# Altium project Single Channel Monitor.PrjPcb
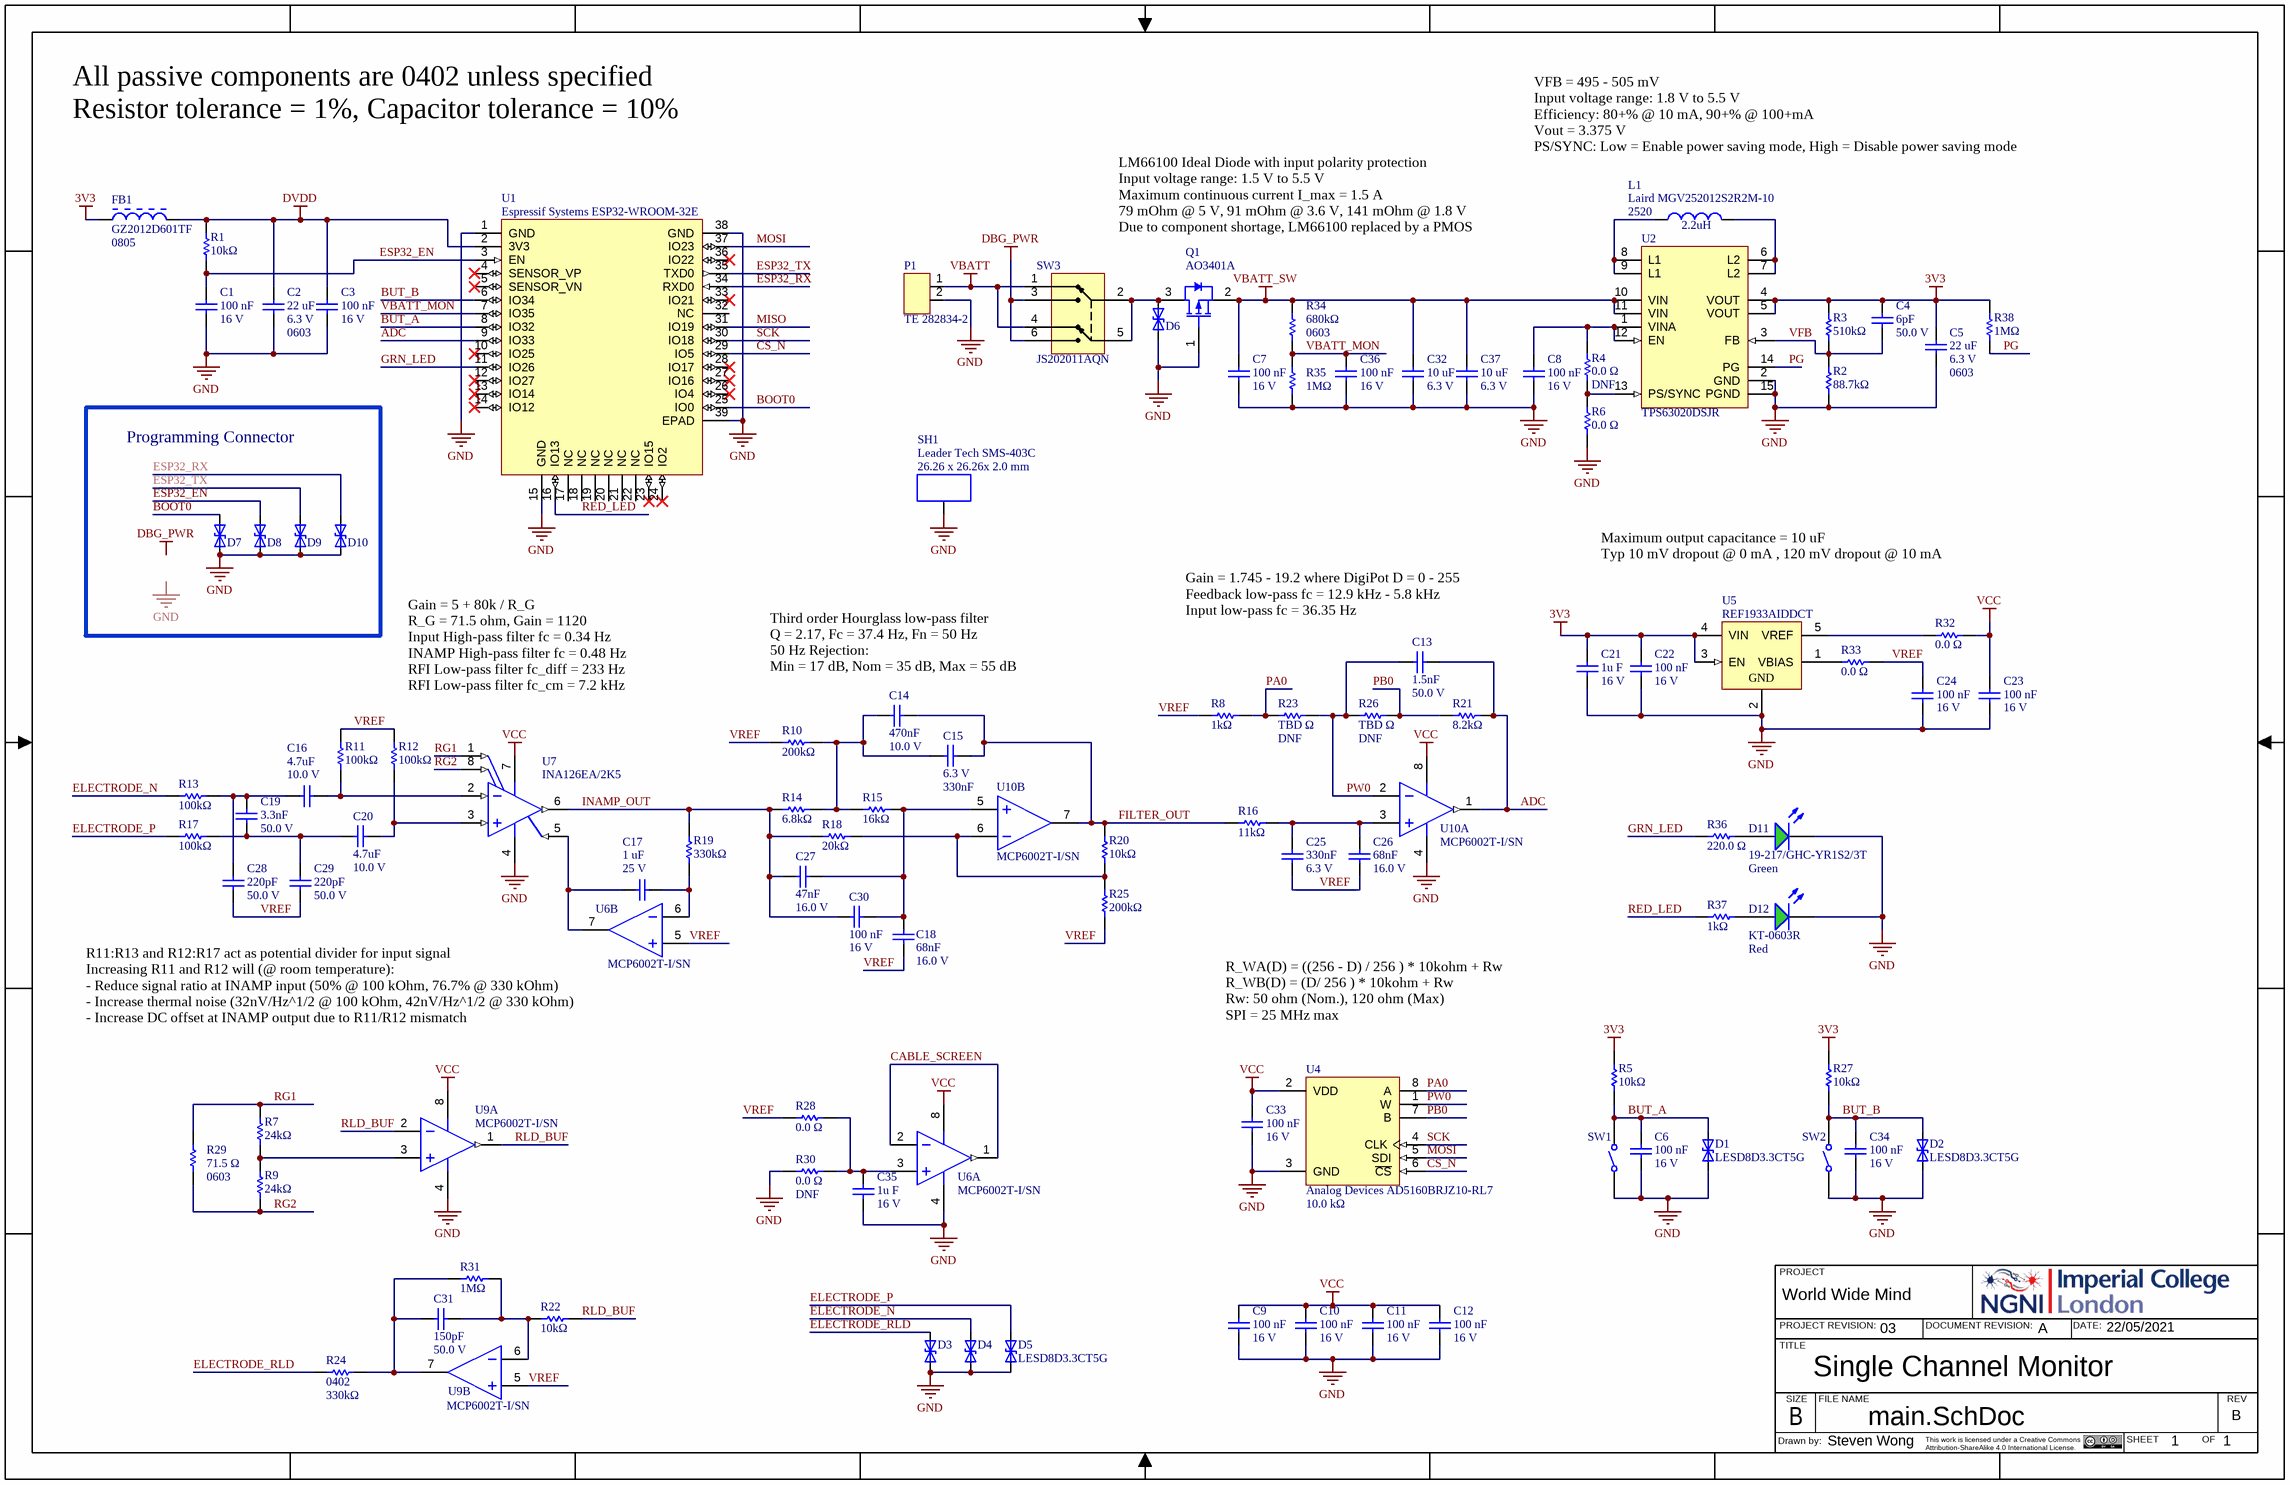
[diagram p0: main.SchDoc]
1 sheet, 103 parts. Net scope: global (net labels, ports and power ports of the same name join across sheets).
Board file: main.PcbDoc

## Sheet main.SchDoc: Single Channel Monitor
size 431 x 279 mm; Date: 22/05/2021; DrawnBy: Steven Wong; SheetNumber: 1; SheetTotal: 1; Project: World Wide Mind; ItemRev: B; ProjectRev: 03; DocumentRev: A

### Parts
C1  Capacitance: 100 nF  Voltage Rating: 16 V  [CAPC1005X56X25NL10T15]  (hidden comment: 100nF)
C2  Capacitance: 22 uF  Voltage Rating (DC): 6.3 V  Package: 0603  [CAPC1608X90X35NL10T15]  (hidden comment: Murata GRM188R60G226MEA0L)
C3  Capacitance: 100 nF  Voltage Rating: 16 V  [CAPC1005X56X25NL10T15]  (hidden comment: 100nF)
C4  Capacitance: 6pF  Voltage Rating (DC): 50.0 V  [CAPC1005X60X25NL10T15]  (hidden comment: AVX Interconnect / Elco 04025A6R0DAT2A)
C5  Capacitance: 22 uF  Voltage Rating (DC): 6.3 V  Package: 0603  [CAPC1608X90X35NL10T15]  (hidden comment: Murata GRM188R60G226MEA0L)
C6  Capacitance: 100 nF  Voltage Rating: 16 V  [CAPC1005X56X25NL10T15]  (hidden comment: 100nF)
C7  Capacitance: 100 nF  Voltage Rating: 16 V  [CAPC1005X56X25NL10T15]  (hidden comment: 100nF)
C8  Capacitance: 100 nF  Voltage Rating: 16 V  [CAPC1005X56X25NL10T15]  (hidden comment: 100nF)
C9  Capacitance: 100 nF  Voltage Rating: 16 V  [CAPC1005X56X25NL10T15]  (hidden comment: 100nF)
C10  Capacitance: 100 nF  Voltage Rating: 16 V  [CAPC1005X56X25NL10T15]  (hidden comment: 100nF)
C11  Capacitance: 100 nF  Voltage Rating: 16 V  [CAPC1005X56X25NL10T15]  (hidden comment: 100nF)
C12  Capacitance: 100 nF  Voltage Rating: 16 V  [CAPC1005X56X25NL10T15]  (hidden comment: 100nF)
C13  Capacitance: 1.5nF  Voltage Rating (DC): 50.0 V  [CAPC1005X56X25NL10T15]  (hidden comment: AVX Interconnect / Elco 04025C152KAT2A)
C14  Capacitance: 470nF  Voltage Rating (DC): 10.0 V  [CAPC1005X56X25NL10T15]  (hidden comment: AVX Interconnect / Elco 0402ZD474KAT2A)
C15  Voltage Rating (DC): 6.3 V  Capacitance: 330nF  [CAPC1005X55X25NL05T10]  (hidden comment: CL05A334KQ5NNNC)
C16  Capacitance: 4.7uF  Voltage Rating (DC): 10.0 V  [CAPC1005X56X25NL10T15]  (hidden comment: CL05A475MP5NRNC)
C17  Voltage Rating (DC): 25 V  Capacitance: 1 uF  [PCB-515da9ytrm2wahx6tw11-1]  (hidden comment: Samsung CL05A105KA5NQNC)
C18  Capacitance: 68nF  Voltage Rating (DC): 16.0 V  [CAPC1005X55X30NL05T10]  (hidden comment: Kemet C0402C683K4RACTU)
C19  Capacitance: 3.3nF  Voltage Rating (DC): 50.0 V  [CAPC1005X56X25NL10T15]  (hidden comment: AVX Interconnect / Elco 04025C332KAT2A)
C20  Capacitance: 4.7uF  Voltage Rating (DC): 10.0 V  [CAPC1005X56X25NL10T15]  (hidden comment: CL05A475MP5NRNC)
C21  Capacitance: 1u F  Voltage Rating (DC): 16 V  [CAPC1005X55X25NL05T10]  (hidden comment: Murata GRM155R61C105KA12D)
C22  Capacitance: 100 nF  Voltage Rating: 16 V  [CAPC1005X56X25NL10T15]  (hidden comment: 100nF)
C23  Capacitance: 100 nF  Voltage Rating: 16 V  [CAPC1005X56X25NL10T15]  (hidden comment: 100nF)
C24  Capacitance: 100 nF  Voltage Rating: 16 V  [CAPC1005X56X25NL10T15]  (hidden comment: 100nF)
C25  Voltage Rating (DC): 6.3 V  Capacitance: 330nF  [CAPC1005X55X25NL05T10]  (hidden comment: CL05A334KQ5NNNC)
C26  Capacitance: 68nF  Voltage Rating (DC): 16.0 V  [CAPC1005X55X30NL05T10]  (hidden comment: Kemet C0402C683K4RACTU)
C27  Capacitance: 47nF  Voltage Rating (DC): 16.0 V  [CAPC1005X56X25NL10T15]  (hidden comment: AVX Interconnect / Elco 04023C473KAT2A)
C28  Capacitance: 220pF  Voltage Rating (DC): 50.0 V  [CAPC1005X55X30NL05T10]  (hidden comment: Kemet C0402C221K5RACAUTO)
C29  Capacitance: 220pF  Voltage Rating (DC): 50.0 V  [CAPC1005X55X30NL05T10]  (hidden comment: Kemet C0402C221K5RACAUTO)
C30  Capacitance: 100 nF  Voltage Rating: 16 V  [CAPC1005X56X25NL10T15]  (hidden comment: 100nF)
C31  Capacitance: 150pF  Voltage Rating (DC): 50.0 V  [CAPC1005X56X25NL10T15]  (hidden comment: AVX Interconnect / Elco 04025A151JAT2A)
C32  Voltage Rating (DC): 6.3 V  Capacitance: 10 uF  [PCB-a41llqp6xpt8gy62f2hk-1]  (hidden comment: Samsung CL05A106MQ5NUNC)
C33  Capacitance: 100 nF  Voltage Rating: 16 V  [CAPC1005X56X25NL10T15]  (hidden comment: 100nF)
C34  Capacitance: 100 nF  Voltage Rating: 16 V  [CAPC1005X56X25NL10T15]  (hidden comment: 100nF)
C35  Capacitance: 1u F  Voltage Rating (DC): 16 V  [CAPC1005X55X25NL05T10]  (hidden comment: Murata GRM155R61C105KA12D)
C36  Capacitance: 100 nF  Voltage Rating: 16 V  [CAPC1005X56X25NL10T15]  (hidden comment: 100nF)
C37  Voltage Rating (DC): 6.3 V  Capacitance: 10 uF  [PCB-a41llqp6xpt8gy62f2hk-1]  (hidden comment: Samsung CL05A106MQ5NUNC)
D1  LESD8D3.3CT5G  [DFN64P100X50-2N]
D2  LESD8D3.3CT5G  [DFN64P100X50-2N]
D3  LESD8D3.3CT5G  [DFN64P100X50-2N]  (value not drawn)
D4  LESD8D3.3CT5G  [DFN64P100X50-2N]  (value not drawn)
D5  LESD8D3.3CT5G  [DFN64P100X50-2N]
D6  LESD8D3.3CT5G  [DFN64P100X50-2N]  (value not drawn)
D7  LESD8D3.3CT5G  [DFN64P100X50-2N]  (value not drawn)
D8  LESD8D3.3CT5G  [DFN64P100X50-2N]  (value not drawn)
D9  LESD8D3.3CT5G  [DFN64P100X50-2N]  (value not drawn)
D10  LESD8D3.3CT5G  [DFN64P100X50-2N]  (value not drawn)
D11  19-217/GHC-YR1S2/3T  Colour: Green  [PCB-qrh50x9m6cshxb6d9t7t-1]
D12  KT-0603R  Colour: Red  [PCB-qrh50x9m6cshxb6d9t7t-1]
FB1  GZ2012D601TF  Case/Package: 0805  [MURA-BLM21-H1-CHIP-2_V]
L1  Laird MGV252012S2R2M-10  Inductance: 2.2uH  Package: 2520  [INDM2520X12N]
P1  TE 282834-2  [PCB-6xrngco598u3mra2uzi2-1]
Q1  AO3401A  [PCB-kx100zt0qwbp6gbfpfbn-1]
R1  Resistance: 10kΩ  [RESC1005X40X25NL05T10]  (hidden comment: Yageo / Phycomp RC0402FR-1310KL)
R2  Resistance: 88.7kΩ  [RESC1005X40X25NL05T05]  (hidden comment: Panasonic ERJ-2RKF8872X)
R3  Resistance: 510kΩ  [RESC1005X40X25NL05T05]  (hidden comment: Vishay Dale CRCW0402510KFKED)
R4  Resistance: 0.0 Ω  Fit: DNF  [RESC1005X37X25NL05T10]  (hidden comment: Yageo AC0402JR-070RL)
R5  Resistance: 10kΩ  [RESC1005X40X25NL05T10]  (hidden comment: Yageo / Phycomp RC0402FR-1310KL)
R6  Resistance: 0.0 Ω  [RESC1005X37X25NL05T10]  (hidden comment: Yageo AC0402JR-070RL)
R7  Resistance: 24kΩ  [RESC1005X40X25NL05T10]  (hidden comment: Yageo / Phycomp RC0402FR-0724KL)
R8  Resistance: 1kΩ  [RESC1005X40X25NL10T10]  (hidden comment: KOA Speer RK73H1ETTP1001F)
R9  Resistance: 24kΩ  [RESC1005X40X25NL05T10]  (hidden comment: Yageo / Phycomp RC0402FR-0724KL)
R10  Resistance: 200kΩ  [RESC1005X40X25NL10T10]  (hidden comment: KOA Speer RK73H1ETTP2003F)
R11  Resistance: 100kΩ  [RESC1005X40X25NL05T10]  (hidden comment: Yageo RC0402FR-13100KL)
R12  Resistance: 100kΩ  [RESC1005X40X25NL05T10]  (hidden comment: Yageo RC0402FR-13100KL)
R13  Resistance: 100kΩ  [RESC1005X40X25NL05T10]  (hidden comment: Yageo RC0402FR-13100KL)
R14  Resistance: 6.8kΩ  [RESC1005X40X25NL05T05]  (hidden comment: Vishay Dale CRCW04026K80FKED)
R15  Resistance: 16kΩ  [RESC1005X40X25NL05T10]  (hidden comment: Yageo / Phycomp RC0402FR-0716KL)
R16  Resistance: 11kΩ  [RESC1005X40X25NL05T10]  (hidden comment: Yageo / Phycomp RC0402FR-0711KL)
R17  Resistance: 100kΩ  [RESC1005X40X25NL05T10]  (hidden comment: Yageo RC0402FR-13100KL)
R18  Resistance: 20kΩ  [RESC1005X40X25NL05T05]  (hidden comment: Panasonic ERJ-2RKF2002X)
R19  Resistance: 330kΩ  [RESC1005X40X25NL05T05]  (hidden comment: Vishay Dale CRCW0402330KFKED)
R20  Resistance: 10kΩ  [RESC1005X40X25NL05T10]  (hidden comment: Yageo / Phycomp RC0402FR-1310KL)
R21  Resistance: 8.2kΩ  [RESC1005X37X25NL05T10]  (hidden comment: Yageo AC0402FR-078K2L)
R22  Resistance: 10kΩ  [RESC1005X40X25NL05T10]  (hidden comment: Yageo / Phycomp RC0402FR-1310KL)
R23  Resistance: TBD Ω  Fit: DNF  [RESC1005X40X25NL05T10]  (hidden comment: Yageo / Phycomp RC0402FR-1310KL)
R24  Case/Package: 0402  Resistance: 330kΩ  [RESC1005X40X25NL05T05]  (hidden comment: Vishay Dale CRCW0402330KFKED)
R25  Resistance: 200kΩ  [RESC1005X40X25NL10T10]  (hidden comment: KOA Speer RK73H1ETTP2003F)
R26  Resistance: TBD Ω  Fit: DNF  [RESC1005X40X25NL05T10]  (hidden comment: Yageo / Phycomp RC0402FR-1310KL)
R27  Resistance: 10kΩ  [RESC1005X40X25NL05T10]  (hidden comment: Yageo / Phycomp RC0402FR-1310KL)
R28  Resistance: 0.0 Ω  [RESC1005X37X25NL05T10]  (hidden comment: Yageo AC0402JR-070RL)
R29  Case/Package: 0603  Resistance: 71.5 Ω  [RESC1608X55X30NL15T15]  (hidden comment: Panasonic ERJ-3EKF71R5V)
R30  Resistance: 0.0 Ω  Fit: DNF  [RESC1005X37X25NL05T10]  (hidden comment: Yageo AC0402JR-070RL)
R31  Resistance: 1MΩ  [RESC1005X37X25NL05T10]  (hidden comment: Yageo AC0402FR-071ML)
R32  Resistance: 0.0 Ω  [RESC1005X37X25NL05T10]  (hidden comment: Yageo AC0402JR-070RL)
R33  Resistance: 0.0 Ω  [RESC1005X37X25NL05T10]  (hidden comment: Yageo AC0402JR-070RL)
R34  Case/Package: 0603  Resistance: 680kΩ  [RESC1609X50X30NL10T20]  (hidden comment: Vishay Dale CRCW0603680KFKEA)
R35  Resistance: 1MΩ  [RESC1005X37X25NL05T10]  (hidden comment: Yageo AC0402FR-071ML)
R36  Resistance: 220.0 Ω  [RESC1005X40X25NL05T05]  (hidden comment: Vishay Dale CRCW0402220RFKED)
R37  Resistance: 1kΩ  [RESC1005X40X25NL05T10]  (hidden comment: Panasonic ERJ-U02F1001X)
R38  Resistance: 1MΩ  [RESC1005X37X25NL05T10]  (hidden comment: Yageo AC0402FR-071ML)
SH1  Leader Tech SMS-403C  Size: 26.26 x 26.26x 2.0 mm  [PCB-mz3zksww60jqn1djdwiu-1]
SW1  TS-1185-C-A-A-A  [PCB-qarcnbrnejma51b9hfzm-1]  (value not drawn)
SW2  TS-1185-C-A-A-A  [PCB-qarcnbrnejma51b9hfzm-1]  (value not drawn)
SW3  JS202011AQN  [PCB-wbq3apgbd2bliremr4t3-1]
U1  Espressif Systems ESP32-WROOM-32E  [ESP32-WROOM-32E]
U2  TPS63020DSJR  [QFN50P300X400X100_HS-15N]
U4  Analog Devices AD5160BRJZ10-RL7  Resistance: 10.0 kΩ  [TSOP65P280X145-8N]
U5  REF1933AIDDCT  [SOT95P280X100-5N]
U6  MCP6002T-I/SN  [SOIC127P600X175-8N]  (parts A,B of 2)
U7  INA126EA/2K5  [TI-DGK8_N]
U9  MCP6002T-I/SN  [SOIC127P600X175-8N]  (parts A,B of 2)
U10  MCP6002T-I/SN  [SOIC127P600X175-8N]  (parts A,B of 2)

### Blocks framed on the sheet
Programming Connector: D7-D10

### Nets
3V3: C4.1 C5.1 C21.1 C22.1 FB1.1 R3.2 R5.1 R27.1 R38.2 U2.4(VOUT) U2.5(VOUT) U5.3(EN) U5.4(VIN)
DBG_PWR: SW3.3 SW3.6
DVDD: C2.1 C3.1 FB1.2 R1.1 U1.2(3V3)
GND: C1.2 C2.2 C3.2 C5.2 C6.2 C7.2 C8.2 C9.2 C10.2 C11.2 C12.2 C21.2 C22.2 C23.2 C24.2 C32.2 C33.2 C34.2 C35.2 C36.2 C37.2 D1.1 D2.1 D3.1 D4.1 D5.1 D6.1 D7.2 D8.2 D9.2 D10.2 D11.2(K) D12.2(K) P1.2 Q1.1(G) R2.1 R6.2 R30.1 R35.2 SH1.1 SW1.1 SW2.1 U1.1(GND) U1.15(GND) U1.38(GND) U1.39(EPAD) U2.2(GND) U2.15(PGND) U4.3(GND) U5.2(GND) U6.4(V-) U7.4(V-) U9.4(V-) U10.4(V-)
VBATT: P1.1 SW3.1 SW3.4
VBATT_SW: C7.1 C32.1 C37.1 Q1.2(S) R34.1 U2.10(VIN) U2.11(VIN)
VCC: C9.1 C10.1 C11.1 C12.1 C23.1 C33.1 R32.1 U4.2(VDD) U6.8(V+) U7.7(V+) U9.8(V+) U10.8(V+)
ADC: C13.1 R21.2 U1.9(IO33) U10.1(OUT1)
BOOT0: D7.1 U1.25(IO0)
BUT_A: C6.1 D1.2 R5.2 SW1.2 U1.8(IO32)
BUT_B: C34.1 D2.2 R27.2 SW2.2 U1.6(IO34)
CABLE_SCREEN: U6.1(OUT1) U6.2(IN1-)
CS_N: U1.29(IO5) U4.6(~{CS})
ELECTRODE_N: D4.2 R13.2
ELECTRODE_P: D5.2 R17.2
ELECTRODE_RLD: D3.2 R24.1
ESP32_EN: C1.1 D8.1 R1.2 U1.3(EN)
ESP32_RX: D10.1 U1.34(RXD0)
ESP32_TX: D9.1 U1.35(TXD0)
FILTER_OUT: C14.2 C15.1 R16.2 R20.1 U10.7(OUT1)
GRN_LED: R36.2 U1.11(IO26)
INAMP_OUT: C27.1 C30.1 R14.1 R18.2 R19.2 U7.6(VO)
MISO: U1.31(IO19)
MOSI: U1.37(IO23) U4.5(SDI)
PA0: R8.1 R23.1 U4.8(A)
PB0: R21.1 R26.1 U4.7(B)
PG: R38.1 U2.14(PG)
PW0: C13.2 R23.2 R26.2 U4.1(W) U10.2(IN1-)
RED_LED: R37.2 U1.16(IO13)
RG1: R7.1 R29.1 U7.1(RG)
RG2: R9.2 R29.2 U7.8(RG)
RLD_BUF: R22.2 U9.1(OUT1) U9.2(IN1-)
SCK: U1.30(IO18) U4.4(CLK)
VBATT_MON: C36.1 R34.2 R35.1 U1.7(IO35)
VFB: C4.2 R2.2 R3.1 U2.3(FB)
VREF: C18.1 C24.1 C25.1 C26.1 C28.2 C29.2 R8.2 R10.1 R11.1 R12.1 R25.1 R28.2 R33.1 U6.5(IN2+) U9.5(IN2+)
NetC8_1: C8.1 R4.2 U2.1(VINA) U2.12(EN)
NetC14_1: C14.1 C15.2 R10.2 R14.2 R15.1
NetC16_1: C16.1 C19.2 C28.1 R13.1
NetC16_2: C16.2 R11.2 U7.2(VIN-)
NetC17_1: C17.1 R19.1 U6.6(IN2-)
NetC17_2: C17.2 U6.7(OUT1) U7.5(REF)
NetC18_2: C18.2 C27.2 C30.2 R15.2 U10.5(IN2+)
NetC19_1: C19.1 C20.2 C29.1 R17.1
NetC20_1: C20.1 R12.2 U7.3(VIN+)
NetC25_2: C25.2 C26.2 R16.1 U10.3(IN1+)
NetC31_1: C31.1 R24.2 R31.2 U9.7(OUT1)
NetC31_2: C31.2 R22.1 R31.1 U9.6(IN2-)
NetC35_1: C35.1 R28.1 R30.2 U6.3(IN1+)
NetD6_2: D6.2 Q1.3(D) SW3.2 SW3.5
NetD11_1: D11.1(A) R36.1
NetD12_1: D12.1(A) R37.1
NetL1_1: L1.1 U2.8(L1) U2.9(L1)
NetL1_2: L1.2 U2.6(L2) U2.7(L2)
NetR4_1: R4.1 R6.1 U2.13(PS/SYNC)
NetR7_2: R7.2 R9.1 U9.3(IN1+)
NetR18_1: R18.1 R20.2 R25.2 U10.6(IN2-)
NetR32_2: R32.2 U5.5(VREF)
NetR33_2: R33.2 U5.1(VBIAS)

Not connected (* = marked no-connect by the designer): U1 4(SENSOR_VP)* 5(SENSOR_VN)* 10(IO25)* 12(IO27)* 13(IO14)* 14(IO12)* 17(NC) 18(NC) 19(NC) 20(NC) 21(NC) 22(NC) 23(IO15)* 24(IO2)* 26(IO4)* 27(IO16)* 28(IO17)* 32(NC) 33(IO21)* 36(IO22)*

### Notes on the sheet
- All passive components are 0402 unless specified
  Resistor tolerance = 1%, Capacitor tolerance = 10%
- VFB = 495 - 505 mV
  Input voltage range: 1.8 V to 5.5 V
  Efficiency: 80+% @ 10 mA, 90+% @ 100+mA
  Vout = 3.375 V
  PS/SYNC: Low = Enable power saving mode, High = Disable power saving mode
- LM66100 Ideal Diode with input polarity protection
  Input voltage range: 1.5 V to 5.5 V
  Maximum continuous current I_max = 1.5 A
  79 mOhm @ 5 V, 91 mOhm @ 3.6 V, 141 mOhm @ 1.8 V
  Due to component shortage, LM66100 replaced by a PMOS
- Maximum output capacitance = 10 uF
  Typ 10 mV dropout @ 0 mA , 120 mV dropout @ 10 mA
- (near C13) Gain = 1.745 - 19.2 where DigiPot D = 0 - 255
  Feedback low-pass fc = 12.9 kHz - 5.8 kHz
  Input low-pass fc = 36.35 Hz
- Gain = 5 + 80k / R_G
  R_G = 71.5 ohm, Gain = 1120
  Input High-pass filter fc = 0.34 Hz
  INAMP High-pass filter fc = 0.48 Hz
  RFI Low-pass filter fc_diff = 233 Hz
  RFI Low-pass filter fc_cm = 7.2 kHz
- (near C14) Third order Hourglass low-pass filter
  Q = 2.17, Fc = 37.4 Hz, Fn = 50 Hz
  50 Hz Rejection:
  Min = 17 dB, Nom = 35 dB, Max = 55 dB
- (near U6) R11:R13 and R12:R17 act as potential divider for input signal
  Increasing R11 and R12 will (@ room temperature):
  - Reduce signal ratio at INAMP input (50% @ 100 kOhm, 76.7% @ 330 kOhm)
  - Increase thermal noise (32nV/Hz^1/2 @ 100 kOhm, 42nV/Hz^1/2 @ 330 kOhm)
  - Increase DC offset at INAMP output due to R11/R12 mismatch
- R_WA(D) = ((256 - D) / 256 ) * 10kohm + Rw
  R_WB(D) = (D/ 256 ) * 10kohm + Rw
  Rw: 50 ohm (Nom.), 120 ohm (Max)
  SPI = 25 MHz max
- Labels drawn without touching a wire or pin: DBG_PWR, GND
- PROJECT
- TITLE
- PROJECT REVISION:
- DOCUMENT REVISION:
- DATE:
- Drawn by:
- SIZE
- B
- FILE NAME
- SHEET
- OF
- REV
- This work is licensed under a Creative Commons Attribution-ShareAlike 4.0 International License.

### Library data of the parts
C1 C3 C6-C12 C22-C24 C30 C33 C34 C36 = CMP-bf2276a55d9a60e5-19: Ceramic capacitor SMD-0402 100nF /16V X7R# K +-10%, Samsung, RoHS; Dielectric Characteristic: X7R; Lead-Free Status: Lead Free; Mounting Style: Surface Mount; Case/Package: 0402; OctopartID: 0755ced2c795d892; LCSC Part #: C1525
C2 C5 = CMP-122043-3: Cap Ceramic 22uF 6.3V X5R 20% SMD 0603 85C Embossed T/R; Capacitance Tolerance: ±20%; Dielectric Characteristic: X5R; Mounting Style: Surface Mount; Number of Pins: 2; Octopart Url: https://octopart.com/grm188r60g226mea0l-murata-18903323; OctopartID: b8387012ec4567ff; Packaging: Cut Tape (CT); REACH SVHC Compliance: No SVHC; RoHS: Compliant; Size-Length: 0.0016 m; Size-Thickness: 0.0008 m; Size-Width: 0.0008 m; Manufacturer Part Number: GRM188R60G226MEA0L; LCSC Part #: C59461
C4 = CMP-173346-2: Multilayer Ceramic Capacitors MLCC - SMD/SMT 50volts 6pF C0G; Dielectric Characteristic: C0G/NP0; Case/Package: 0402; Octopart Url: https://octopart.com/04025a6r0dat2a-avx+interconnect+%2F+elco-2464711; OctopartID: ec20250f528133e7; Packaging: Tape; RoHS: Compliant; Manufacturer Part Number: 04025A6R0DAT2A; LCSC Part #: C30274
C13 = CMP-126494-2: Cap Ceramic 0.0015uF 50V X7R 10% SMD 0402 125C Paper T/R; Lead-Free Status: Lead Free; Manufacturer Part Number: 04025C152KAT2A; Capacitance Tolerance: ±10%; Case/Package: 0402; Dielectric Characteristic: X7R; Mounting Style: Surface Mount; Number of Pins: 2; Octopart Url: https://octopart.com/04025c152kat2a-avx+interconnect+%2F+elco-194735; OctopartID: 4e80878893499147; REACH SVHC Compliance: No SVHC; RoHS: Compliant; Size-Height: 0.00056 m; Size-Length: 0.001 m; Size-Width: 0.0005 m; LCSC Part #: C23967
C14 = CMP-4106702-2: Multilayer Ceramic Capacitors MLCC - SMD/SMT 10volts 0.47uF 10% X5R; Manufacturer Part Number: 0402ZD474KAT2A; Capacitance Tolerance: ±10%; Case/Package: 0402; Dielectric Characteristic: X5R; Mounting Style: Surface Mount; Octopart Url: https://octopart.com/0402zd474kat2a-avx+interconnect+%2F+elco-22263019; OctopartID: 2f8be7d2be06f04c; RoHS: Compliant; LCSC Part #: C47339
C15 C25 = CMP-119553-3: CAP CER 0.33UF 10V 10% X5R 0402; Lead-Free Status: Lead Free; Lifecycle Status: Active; Mounting Style: Surface Mount; Size-Height: 0.0005 m; Capacitance Tolerance: ±10%; REACH SVHC Compliance: No SVHC; OctopartID: adff64f6898b7238; Size-Length: 0.001 m; RoHS: Compliant; Manufacturer Part Number: CL05A334KQ5NNNC; LCSC Part #: C307420
C16 C20 = CMP-19563753-2: T&R / COMMERCIAL CHIP; Capacitance Tolerance: ±20%; Dielectric Characteristic: X5R; Lead-Free Status: Lead Free; Manufacturer Part Number: CL05A475MP5NRNC; Case/Package: 0402; Octopart Url: https://octopart.com/04026d475mat2a-avx+interconnect+%2F+elco-33966492; OctopartID: 16c3ddcf7a39c904; RoHS: Compliant; LCSC Part #: C23733
C17 = CMP-8f214705328650e6-4: Cap Ceramic 1uF 25V X5R 10% SMD 0402 85°C Cardboard T/R; Lead-Free Status: Lead Free; Package: 0402; Octopart URL: https://octopart.com/cl05a105ka5nqnc-samsung-19830977; Manufacturer Part Number: CL05A105KA5NQNC; RoHS: Compliant; OctopartID: 8f214705328650e6; LCSC Part #: C52923
C18 C26 = CMP-124577-2: CAP CER 0.068UF 16V 10% X7R 0402; Dielectric Material: Ceramic; Lead-Free Status: R; Capacitance Tolerance: ±10%; Case/Package: 0402; Dielectric Characteristic: X7R; Mounting Style: Surface Mount; Number of Pins: 2; Octopart Url: https://octopart.com/c0402c683k4ractu-kemet-89461; OctopartID: f9793072816a26be; Packaging: Cut Tape (CT); REACH SVHC Compliance: No SVHC; RoHS: Compliant; Size-Height: 0.0005 m; Size-Length: 0.001 m; Size-Width: 0.0005 m; Manufacturer Part Number: C0402C683K4RACTU; LCSC Part #: C12529
C19 = CMP-128367-2: AVX   04025C332KAT2A   CAP, MLCC, X7R, 3.3NF, 50V, 0402; Capacitance Tolerance: ±10%; Dielectric Material: Ceramic Multilayer; Lead-Free Status: Lead Free; Case/Package: 0402; Dielectric Characteristic: X7R; Mounting Style: Surface Mount; Number of Pins: 2; Octopart Url: https://octopart.com/04025c332kat2a-avx+interconnect+%2F+elco-194738; OctopartID: ed87248f30533240; REACH SVHC Compliance: No SVHC; RoHS: Compliant; Size-Height: 0.00056 m; Size-Length: 0.001 m; Size-Width: 0.0005 m; Manufacturer Part Number: 04025C332KAT2A; LCSC Part #: C26404
C21 C35 = CMP-7562325-2: Cap Ceramic 1uF 16V X5R 10% SMD 0402 85C Paper T/R; Lead-Free Status: Lead Free; Capacitance Tolerance: ±10%; Dielectric Characteristic: X5R; Lifecycle Status: Active; Octopart Url: https://octopart.com/grm155r61c105ka12d-murata-21407243; OctopartID: 62f2aabee19fbd35; Packaging: Cut Tape (CT); REACH SVHC Compliance: No SVHC; RoHS: Compliant; Size-Length: 0.001 m; Size-Thickness: 0.0005 m; Size-Width: 0.0005 m; Manufacturer Part Number: GRM155R61C105KA12D; Package: 0402; LCSC Part #: C52923
C27 = CMP-8988077-2: Multilayer Ceramic Capacitors MLCC - SMD/SMT 25volts 0.047uF 10% X7R 0402 SIZE; Lead-Free Status: Lead Free; Capacitance Tolerance: ±10%; Case/Package: 0402; Dielectric Characteristic: X7R; Octopart Url: https://octopart.com/04023c473kat2a-avx+interconnect+%2F+elco-27697901; OctopartID: 725fbaf3f5d4ad98; RoHS: Compliant; Manufacturer Part Number: 04023C473KAT2A; LCSC Part #: C26403
C28 C29 = CMP-3913259-2: CAPACITOR, 0402, X7R, 50V, 220PF; Capacitance Tolerance: ±10%; Dielectric Material: Ceramic; Lead-Free Status: R; Manufacturer Part Number: C0402C221K5RACAUTO; Case/Package: 0402; Dielectric Characteristic: X7R; Mounting Style: Surface Mount; Octopart Url: https://octopart.com/c0402c221k5racauto-kemet-31521984; OctopartID: 55129df88cb48ad5; Packaging: Cut Tape (CT); REACH SVHC Compliance: No SVHC; RoHS: Compliant; LCSC Part #: C1530
C31 = CMP-128358-2: AVX   04025A151JAT2A   CAP, MLCC, C0G/NP0, 150PF, 50V, 0402; Capacitance Tolerance: ±5%; Dielectric Material: Ceramic Multilayer; Lead-Free Status: Lead Free; Temperature Coefficient: 0.0 ppm/°C; Case/Package: 0402; Dielectric Characteristic: C0G/NP0; Mounting Style: Surface Mount; Number of Pins: 2; Octopart Url: https://octopart.com/04025a151jat2a-avx+interconnect+%2F+elco-194717; OctopartID: fa6a3362279125ad; REACH SVHC Compliance: No SVHC; RoHS: Compliant; Size-Height: 0.00056 m; Size-Length: 0.001 m; Size-Width: 0.0005 m; Manufacturer Part Number: 04025A151JAT2A; LCSC Part #: C1527
C32 C37 = CMP-fd5e350784e62299-2: Cap Ceramic 10uF 6.3V X5R 20% SMD 0402 85°C Paper T/R; Lead-Free Status: Lead Free; Octopart URL: https://octopart.com/cl05a106mq5nunc-samsung-22240478; Manufacturer Part Number: CL05A106MQ5NUNC; Mounting Style: Surface Mount; RoHS: Compliant; OctopartID: fd5e350784e62299; Package: 0402; LCSC Part #: C15525
D1-D10 = CMP-zjatvudan2pmebzuzrjd-1: Bidirectional 3.3V (Max) 5V 14.1V 11.2A(8/20us) SOD-882 Diodes - ESD RoHS; Manufacturer: LRC; Breakdown Voltage: 5.0 V; Maximum Reverse Leakage Current: 1 uA; Manufacturer Part Number: LESD8D3.3CT5G; Homepage URL: https://lcsc.com/product-detail/Diodes-ESD_LESD8D3-3CT5G_C172410.html; CustomComponentID: zjatvudan2pmebzuzrjd; Package: SOD-882; LCSC Part #: C172410
D11 D12 = CMP-7093b92408b7af54-1: LED SMD Top View Uni-Color Brilliant Green 518nm 0603 Pkg ø7T/R 3k"; OctopartID: 7093b92408b7af54; Octopart URL: https://octopart.com/19-217%2Fghc-yr1s2%2F3t-everlight-12410178
  D11: LCSC Part #: C72043
  D12: LCSC Part #: C2286
FB1 = CMP-887293-3: Chip Ferrite Bead for High Speed Signal lines, 330 Ohm, 400 mA, -55 to 125 degC, 2 x 1.25 x 1.05 mm SMD, Tape and Reel; Manufacturer Part Number: BLM21BB331SN1D; Case/Package (SI): 2012; Lead-Free Status: Lead Free; Number of Circuits: 1; Resistance: 330.0 Ω; Shielding: No; Mounting Style: Surface Mount; Number of Pins: 2; Octopart Url: https://octopart.com/blm21bb331sn1d-murata-47768; OctopartID: f6a33fa9695d2964; Packaging: Cut Tape (CT); REACH SVHC Compliance: No SVHC; RoHS: Compliant; Size-Length: 0.002 m; Size-Width: 0.00125 m; LCSC Part #: C1017
L1 = CMP-6756ab2d39beb891-1: MGV252012 - High Current Molded SMT Power Inductor; Octopart URL: https://octopart.com/mgv252012s2r2m-10-laird-91323278; Manufacturer Part Number: MGV252012S2R2M-10; RoHS: Compliant; OctopartID: 6756ab2d39beb891; LCSC Part #: C375952
P1 = CMP-4e52859dc8429195-26: Wire-To-Board Terminal Block, 2, 150 V, 10 A, 30 Awg, 16 Awg, 1.4 Mm; Number of Contacts: 2; Lead-Free Status: Lead Free; Wire Gauge: 16.0 AWG to 30.0 AWG; ELV Compliant: Compliant; Size-Width: 6.50 mm; Contact Plating: Tin; Mounting Style: Screw, Through Hole; RoHS: Compliant; Color: Green; Flammability Rating: UL 94 V-0; Contact Material: Brass; Octopart URL: https://octopart.com/282834-2-te+connectivity-46506870
Q1 = CMP-832298-9: MOSFET P-CH 30V 4A SOT23; Manufacturer: Alpha & Omega Semicon; LCSC Part #: C15127
R1 R5 R20 R22 R23 R26 R27 = CMP-3661304-2: Thick Film Resistors - SMD 10K OHM 1%; Lead-Free Status: Lead Free; Power Rating: 0.0625 W; Voltage Rating (DC): 50.0 V; Case/Package: 0402; Mounting Style: Surface Mount; Number of Pins: 2; Octopart Url: https://octopart.com/rc0402fr-1310kl-yageo-42863452; OctopartID: f5673ee3db5d2aa0; Packaging: Cut Tape (CT); Resistance Tolerance: ±1%; RoHS: Compliant; Size-Length: 0.001 m; Manufacturer Part Number: RC0402FR-1310KL; LCSC Part #: C25744
R2 = CMP-3682312-2: Thick Film Resistors - SMD 0402 88.7Kohms 1% Tol; Lead-Free Status: Lead Free; Power Rating: 0.1 W; Voltage Rating (DC): 50.0 V; Case/Package: 0402; Lifecycle Status: Not Listed by Manufacturer; Mounting Style: Surface Mount; Octopart Url: https://octopart.com/erj-2rkf8872x-panasonic-55421318; OctopartID: a0346a732cd47ff3; REACH SVHC Compliance: No SVHC; Resistance Tolerance: ±1%; RoHS: Compliant; Size-Height: 0.00035 m; Size-Length: 0.001 m; Size-Width: 0.0005 m; Manufacturer Part Number: ERJ-2RKF8872X; LCSC Part #: C25922
R3 = CMP-3945506-8: RES SMD 510K OHM 1% 1/16W 0402; Lead-Free Status: Lead Free; Power Rating: 0.063 W; Voltage Rating (DC): 50.0 V; Case/Package: 0402; Mounting Style: Surface Mount; Number of Pins: 2; Octopart Url: https://octopart.com/crcw0402510kfked-vishay-39803012; OctopartID: ab2d6078d6cf74ea; REACH SVHC Compliance: No SVHC; Resistance Tolerance: ±1%; RoHS: Compliant; Size-Height: 0.00035 m; Size-Length: 0.001 m; Size-Width: 0.0005 m; Manufacturer Part Number: CRCW0402510KFKED; LCSC Part #: C11616
R4 R6 R28 R30 R32 R33 = CMP-1900348-2: RES SMD 0.0 OHM JUMPER 1/16W; Lead-Free Status: Lead Free; Resistance Tolerance: ±5%; Manufacturer Part Number: AC0402JR-070RL; Case/Package: 0402; Mounting Style: Surface Mount; Octopart Url: https://octopart.com/ac0402jr-070rl-yageo-21711084; OctopartID: 9e9b56daf311415c; RoHS: Compliant; LCSC Part #: C17168
R7 R9 = CMP-1900184-2: RESISTOR, 0402 0.063W 1% 24K; Lead-Free Status: Lead Free; Power Rating: 0.0625 W; Voltage Rating (DC): 50.0 V; Manufacturer Part Number: RC0402FR-0724KL; Case/Package: 0402; Mounting Style: Surface Mount; Number of Pins: 2; Octopart Url: https://octopart.com/rc0402fr-0724kl-yageo-42334447; OctopartID: 081fc390d596d7d8; REACH SVHC Compliance: No SVHC; Resistance Tolerance: ±1%; RoHS: Compliant; LCSC Part #: C25769
R8 = CMP-2823544-2: Res Thick Film 0402 1K Ohm 1% 0.063W(1/16W) ±100ppm/C Molded SMD Automotive Punched Paper T/R; Lead-Free Status: Lead Free; Temperature Coefficient: 100.0 ppm/°C; Voltage Rating (DC): 50.0 V; Case/Package: 0402; Octopart Url: https://octopart.com/rk73h1ettp1001f-koa+speer-2165773; OctopartID: 54d59dfe7dbe8b12; Power Rating: 0.063 W; Resistance Tolerance: ±1%; RoHS: Compliant; Size-Length: 0.001 m; Size-Width: 0.0005 m; Manufacturer Part Number: RK73H1ETTP1001F; LCSC Part #: C11702
R10 R25 = CMP-2823564-2: Res Thick Film 0402 200K Ohm 1% 0.063W(1/16W) ±100ppm/C Molded SMD Automotive Punched Paper T/R; Lead-Free Status: Lead Free; Temperature Coefficient: 100.0 ppm/°C; Voltage Rating (DC): 50.0 V; Manufacturer Part Number: RK73H1ETTP2003F; Case/Package: 0402; Octopart Url: https://octopart.com/rk73h1ettp2003f-koa+speer-2165923; OctopartID: dfa21689f6670065; Power Rating: 0.063 W; Resistance Tolerance: ±1%; RoHS: Compliant; Size-Length: 0.001 m; Size-Width: 0.0005 m; LCSC Part #: C25764
R11-R13 R17 = CMP-3759242-3: YAGEO   RC0402FR-13100KL   THICK FILM RESISTOR, 100KOHM, 62.5mW 1%; Power Rating: 0.0625 W; Voltage Rating (DC): 50.0 V; Lead-Free Status: Lead Free; Size-Length: 0.001 m; RoHS: Compliant; Case/Package: 0402; Packaging: Cut Tape (CT); Manufacturer Part Number: RC0402FR-13100KL; OctopartID: 302bf9acc9e8efec; Resistance Tolerance: ±1%; Mounting Style: Surface Mount; Octopart Url: https://octopart.com/rc0402fr-13100kl-yageo-9297061; LCSC Part #: C25741
R14 = CMP-1856508-2: RES SMD 6.8K OHM 1% 1/16W 0402; Lead-Free Status: Lead Free; Power Rating: 0.063 W; Voltage Rating (DC): 50.0 V; Case/Package: 0402; Mounting Style: Surface Mount; Number of Pins: 2; Octopart Url: https://octopart.com/crcw04026k80fked-vishay-39792196; OctopartID: 1199dacc1abbce5e; REACH SVHC Compliance: No SVHC; Resistance Tolerance: ±1%; RoHS: Compliant; Size-Height: 0.00035 m; Size-Length: 0.001 m; Size-Width: 0.0005 m; Manufacturer Part Number: CRCW04026K80FKED; LCSC Part #: C25917
R15 = CMP-1853199-2: YAGEO (PHYCOMP)   RC0402FR-0716KL   RESISTOR, 0402 0.063W 1% 16K; Lead-Free Status: Lead Free; Voltage Rating (DC): 50.0 V; Manufacturer Part Number: RC0402FR-0716KL; Case/Package: 0402; Mounting Style: Surface Mount; Number of Pins: 2; Octopart Url: https://octopart.com/rc0402fr-0716kl-yageo-39807370; OctopartID: c1cb0a9e8d271e0c; Packaging: Cut Tape (CT); Power Rating: 0.063 W; REACH SVHC Compliance: No SVHC; Resistance Tolerance: ±1%; RoHS: Compliant; Size-Height: 0.00035 m; Size-Length: 0.001 m; Size-Width: 0.0005 m; LCSC Part #: C25759
R16 = CMP-1853185-2: RES SMD 11K OHM 1% 1/16W 0402; Lead-Free Status: Lead Free; Power Rating: 0.063 W; Voltage Rating (DC): 50.0 V; Case/Package: 0402; Mounting Style: Surface Mount; Number of Pins: 2; Octopart Url: https://octopart.com/rc0402fr-0711kl-yageo-39819140; OctopartID: 66c7ad92d425b900; REACH SVHC Compliance: No SVHC; Resistance Tolerance: ±1%; RoHS: Compliant; Size-Height: 0.00035 m; Size-Length: 0.001 m; Size-Width: 0.0005 m; Manufacturer Part Number: RC0402FR-0711KL; LCSC Part #: C25749
R18 = CMP-3656287-2: Thick Film Resistors - SMD 0402 20Kohms 1% Tol; Lead-Free Status: Lead Free; Power Rating: 0.1 W; Voltage Rating (DC): 50.0 V; Case/Package: 0402; Lifecycle Status: Not Listed by Manufacturer; Mounting Style: Surface Mount; Octopart Url: https://octopart.com/erj-2rkf2002x-panasonic-55477596; OctopartID: 5ccd9689fcf7830a; Packaging: Cut Tape (CT); REACH SVHC Compliance: No SVHC; Resistance Tolerance: ±1%; RoHS: Compliant; Size-Height: 0.00035 m; Size-Length: 0.001 m; Size-Width: 0.0005 m; Manufacturer Part Number: ERJ-2RKF2002X; LCSC Part #: C25765
R19 R24 = CMP-1856416-2: RES SMD 330K OHM 1% 1/16W 0402; Lead-Free Status: Lead Free; Power Rating: 0.063 W; Voltage Rating (DC): 50.0 V; Mounting Style: Surface Mount; Number of Pins: 2; Octopart Url: https://octopart.com/crcw0402330kfked-vishay-39868742; OctopartID: 7586beec09a6aa41; REACH SVHC Compliance: No SVHC; Resistance Tolerance: ±1%; RoHS: Compliant; Size-Height: 0.00035 m; Size-Length: 0.001 m; Size-Width: 0.0005 m; Manufacturer Part Number: CRCW0402330KFKED; LCSC Part #: C25778
  R19: Case/Package: 0402
R21 = CMP-9399996-2: 0402 8.2k ohms 1% automotive grade chip resistor; Lead-Free Status: Lead Free; Manufacturer Part Number: AC0402FR-078K2L; Case/Package: 0402; Mounting Style: Surface Mount; Octopart Url: https://octopart.com/ac0402fr-078k2l-yageo-24618202; OctopartID: c89200ef492e1755; Resistance Tolerance: ±1%; RoHS: Compliant; LCSC Part #: C25924
R29 = CMP-3679617-2: Thick Film Resistors - SMD 0603 71.5ohms 1% Tol; Lead-Free Status: Lead Free; Power Rating: 0.1 W; Voltage Rating (DC): 75.0 V; Lifecycle Status: Not Listed by Manufacturer; Mounting Style: Surface Mount; Octopart Url: https://octopart.com/erj-3ekf71r5v-panasonic-55421901; OctopartID: 7ca3b6e4f208a364; REACH SVHC Compliance: No SVHC; Resistance Tolerance: ±1%; RoHS: Compliant; Size-Height: 0.00045 m; Size-Length: 0.0016 m; Size-Width: 0.0008 m; Manufacturer Part Number: ERJ-3EKF71R5V; LCSC Part #: C23104
R31 R35 R38 = CMP-7833283-2: Thick Film Resistors 1/16W 1M ohm 1%; Lead-Free Status: Lead Free; Manufacturer Part Number: AC0402FR-071ML; Case/Package: 0402; Mounting Style: Surface Mount; Octopart Url: https://octopart.com/ac0402fr-071ml-yageo-24618158; OctopartID: 4bcf83b2ca079408; Resistance Tolerance: ±1%; RoHS: Compliant; LCSC Part #: C26083
R34 = CMP-1873487-2: RES SMD 680K OHM 1% 1/10W 0603; Lead-Free Status: Lead Free; Power Rating: 0.1 W; Voltage Rating (DC): 75.0 V; Mounting Style: Surface Mount; Number of Pins: 2; Octopart Url: https://octopart.com/crcw0603680kfkea-vishay-39797441; OctopartID: 7f5eb40b18f9a099; REACH SVHC Compliance: No SVHC; Resistance Tolerance: ±1%; RoHS: Compliant; Size-Height: 0.00045 m; Size-Length: 0.00155 m; Size-Width: 0.00085 m; Manufacturer Part Number: CRCW0603680KFKEA; LCSC Part #: C25822
R36 = CMP-1867363-2: RES SMD 220 OHM 1% 1/16W 0402; Lead-Free Status: Lead Free; Power Rating: 0.063 W; Voltage Rating (DC): 50.0 V; Case/Package: 0402; Mounting Style: Surface Mount; Number of Pins: 2; Octopart Url: https://octopart.com/crcw0402220rfked-vishay-39713545; OctopartID: e7822cd539ed3845; REACH SVHC Compliance: No SVHC; Resistance Tolerance: ±1%; RoHS: Compliant; Size-Height: 0.00035 m; Size-Length: 0.001 m; Size-Width: 0.0005 m; Manufacturer Part Number: CRCW0402220RFKED; LCSC Part #: C25091
R37 = CMP-9105019-2: Thick Film Resistors - SMD 0402 1% 1.0Kohm Anti-Sulfur; Power Rating: 0.1 W; Voltage Rating (DC): 50.0 V; Manufacturer Part Number: ERJ-U02F1001X; Case/Package: 0402; Lifecycle Status: Not Listed by Manufacturer; Octopart Url: https://octopart.com/erj-u02f1001x-panasonic-26471532; OctopartID: b0e0787979ea6f27; Resistance Tolerance: ±1%; RoHS: Compliant; LCSC Part #: C11702
SH1 = CMP-da641787f57f05a3-1: EMI SHIELDING, 26.87 X 26.87 X 2.01MM; Product Range: Two-Piece SMS Series; Gasket Material: Tin Plated Steel;...; Octopart URL: https://octopart.com/sms-403c-leader+tech-82381437; Manufacturer Part Number: SMS-403C; OctopartID: da641787f57f05a3
SW1 SW2 = CMP-hgui3ccx9uakpoe7vbsx-5: SPST 50mA @ 12VDC Vertical Round Button 260gf SMD Tactile Switches RoHS; Manufacturer: XKB Connectivity; LCSC Part #: C561518; Manufacturer Part Number: TS-1185-C-A-A-A; CustomComponentID: hgui3ccx9uakpoe7vbsx; Homepage URL: https://lcsc.com/product-detail/Tactile-Switches_XKB-Connectivity-TS-1185-C-A-A-A_C561518.html
SW3 = CMP-c7970ef1edec1850-5: Switch Slide DPDT Side Slide 0.3A 30VDC PC Pins Thru-Hole Bulk; Mounting Style: Through Hole, PC Board; OctopartID: c7970ef1edec1850; RoHS: Compliant; REACH SVHC Compliance: No SVHC; LCSC Part #: C221662
U1 = CMP-313bfeb3df46eefc-3: Rx Txrx Mod Wifi Trace Ant SMD; Octopart URL: https://octopart.com/esp32-wroom-32e%28m113eh2800ph3q0%29-espressif+systems-109234971; Manufacturer Part Number: ESP32-WROOM-32E; LCSC Part #: C701341
U2 = CMP-70a5b95f396aaf62-2: High Efficiency Single Inductor Buck-Boost Converter with 4A Switch 14-VSON -40 to 125; Lead-Free Status: Lead Free; Number of Regulated Outputs: 1; Output Current: 4.00 A; Output Voltage: 1.20 V (min); Quiescent Current: 50.0 µA; Octopart URL: https://octopart.com/tps63020dsjr-texas+instruments-15756457; Manufacturer Part Number: TPS63020DSJR; Lifecycle Status: Active; Mounting Style: Surface Mount; Operating Temperature: -40.0 °C (min); Packaging: Cut Tape (CT), Tape & Reel (TR); Number of Pins: 14; RoHS: Compliant; OctopartID: 70a5b95f396aaf62; LCSC Part #: C15483
U4 = CMP-6bc4a2c881d8b403-1: Digital Potentiometer 10kOhm 256POS Volatile Linear Automotive 8-Pin SOT-23 T/R; Clock Speed: 25.0 MHz (max); Lead-Free Status: Lead Free; Number of Circuits: 1; Quiescent Current: 3.00 µA; Resistance Tolerance: ±15%; Supply Voltage (DC): 5.50 V (max), 2.70 V (min); Temperature Coefficient: 45.0 ppm/°C; Octopart URL: https://octopart.com/ad5160brjz10-rl7-analog+devices-446330; Manufacturer Part Number: AD5160BRJZ10-RL7; Case/Package: SOT-23; Lifecycle Status: Active; Mounting Style: Surface Mount; Operating Temperature: 125 °C (max); Packaging: Cut Tape (CT); Number of Pins: 8; REACH SVHC Compliance: No SVHC; RoHS: Compliant; Supply Current: 3.00 µA; OctopartID: 6bc4a2c881d8b403; LCSC Part #: C40097
U5 = CMP-b2327839c6726df5-7: 3.3-V Vref, dual-output Vref & Vref/2 voltage reference 5-SOT-23-THIN -40 to 125; Lead-Free Status: Lead Free; Quiescent Current: 360 µA; Temperature Coefficient: -10.0 ppm/°C to 10.0 ppm/°C; Octopart URL: https://octopart.com/ref1933aiddct-texas+instruments-50417958; Manufacturer Part Number: REF1933AIDDCT; Case/Package: TSOT-23-5, SOT-23-5; Lifecycle Status: Pre-Release; Mounting Style: Surface Mount; Operating Temperature: -40.0 °C (min); Packaging: Cut Tape (CT); Number of Pins: 5; REACH SVHC Compliance: No SVHC; RoHS: Compliant; OctopartID: b2327839c6726df5
U6 U9 U10 = CMP-cf0503be886010c2-1: 5MHz 15V/us High Slew-Rate RRIO Operational Amplifier 8-Pin SOIC T/R; Manufacturer Part Number: TLV9052IDR; Gain Bandwidth Product: 5.00 MHz; Input Offset Drift: 1.00 µV/K; Slew Rate: 13.0 V/?s; Octopart URL: https://octopart.com/tlv9052idr-texas+instruments-95511043; Case/Package: SOIC; Lifecycle Status: Pre-Release; Operating Temperature: -40.0 °C to 125 °C; Number of Pins: 8; RoHS: Compliant; OctopartID: cf0503be886010c2; LCSC Part #: C7377
U7 = CMP-1215678-2: Micropower Instrumentation Amplifier Single and Dual Versions, -40 to 85 degC, 8-pin SOP (DGK8), Green (RoHS & no Sb/Br); Bandwidth: 200000.0 Hz; Lead-Free Status: Lead Free; Number of Channels: 1; Quiescent Current: 0.000175 A; Slew Rate: 0.04 V/μs; Case/Package: MSOP; Lifecycle Status: Active; Mounting Style: Surface Mount; Number of Circuits: 1; Number of Pins: 8; Octopart Url: https://octopart.com/ina126ea%2F2k5-texas+instruments-414235; OctopartID: 88fe41f2ff835739; Packaging: Tape & Reel (TR); RoHS: Compliant; Supply Current: 0.000175 A; Manufacturer Part Number: INA126EA/2K5

## Assembly variants
base: not fitted R4 R23 R26 R30